# EAGLE design MOSFET PCB (EAGLE 9.4.2)
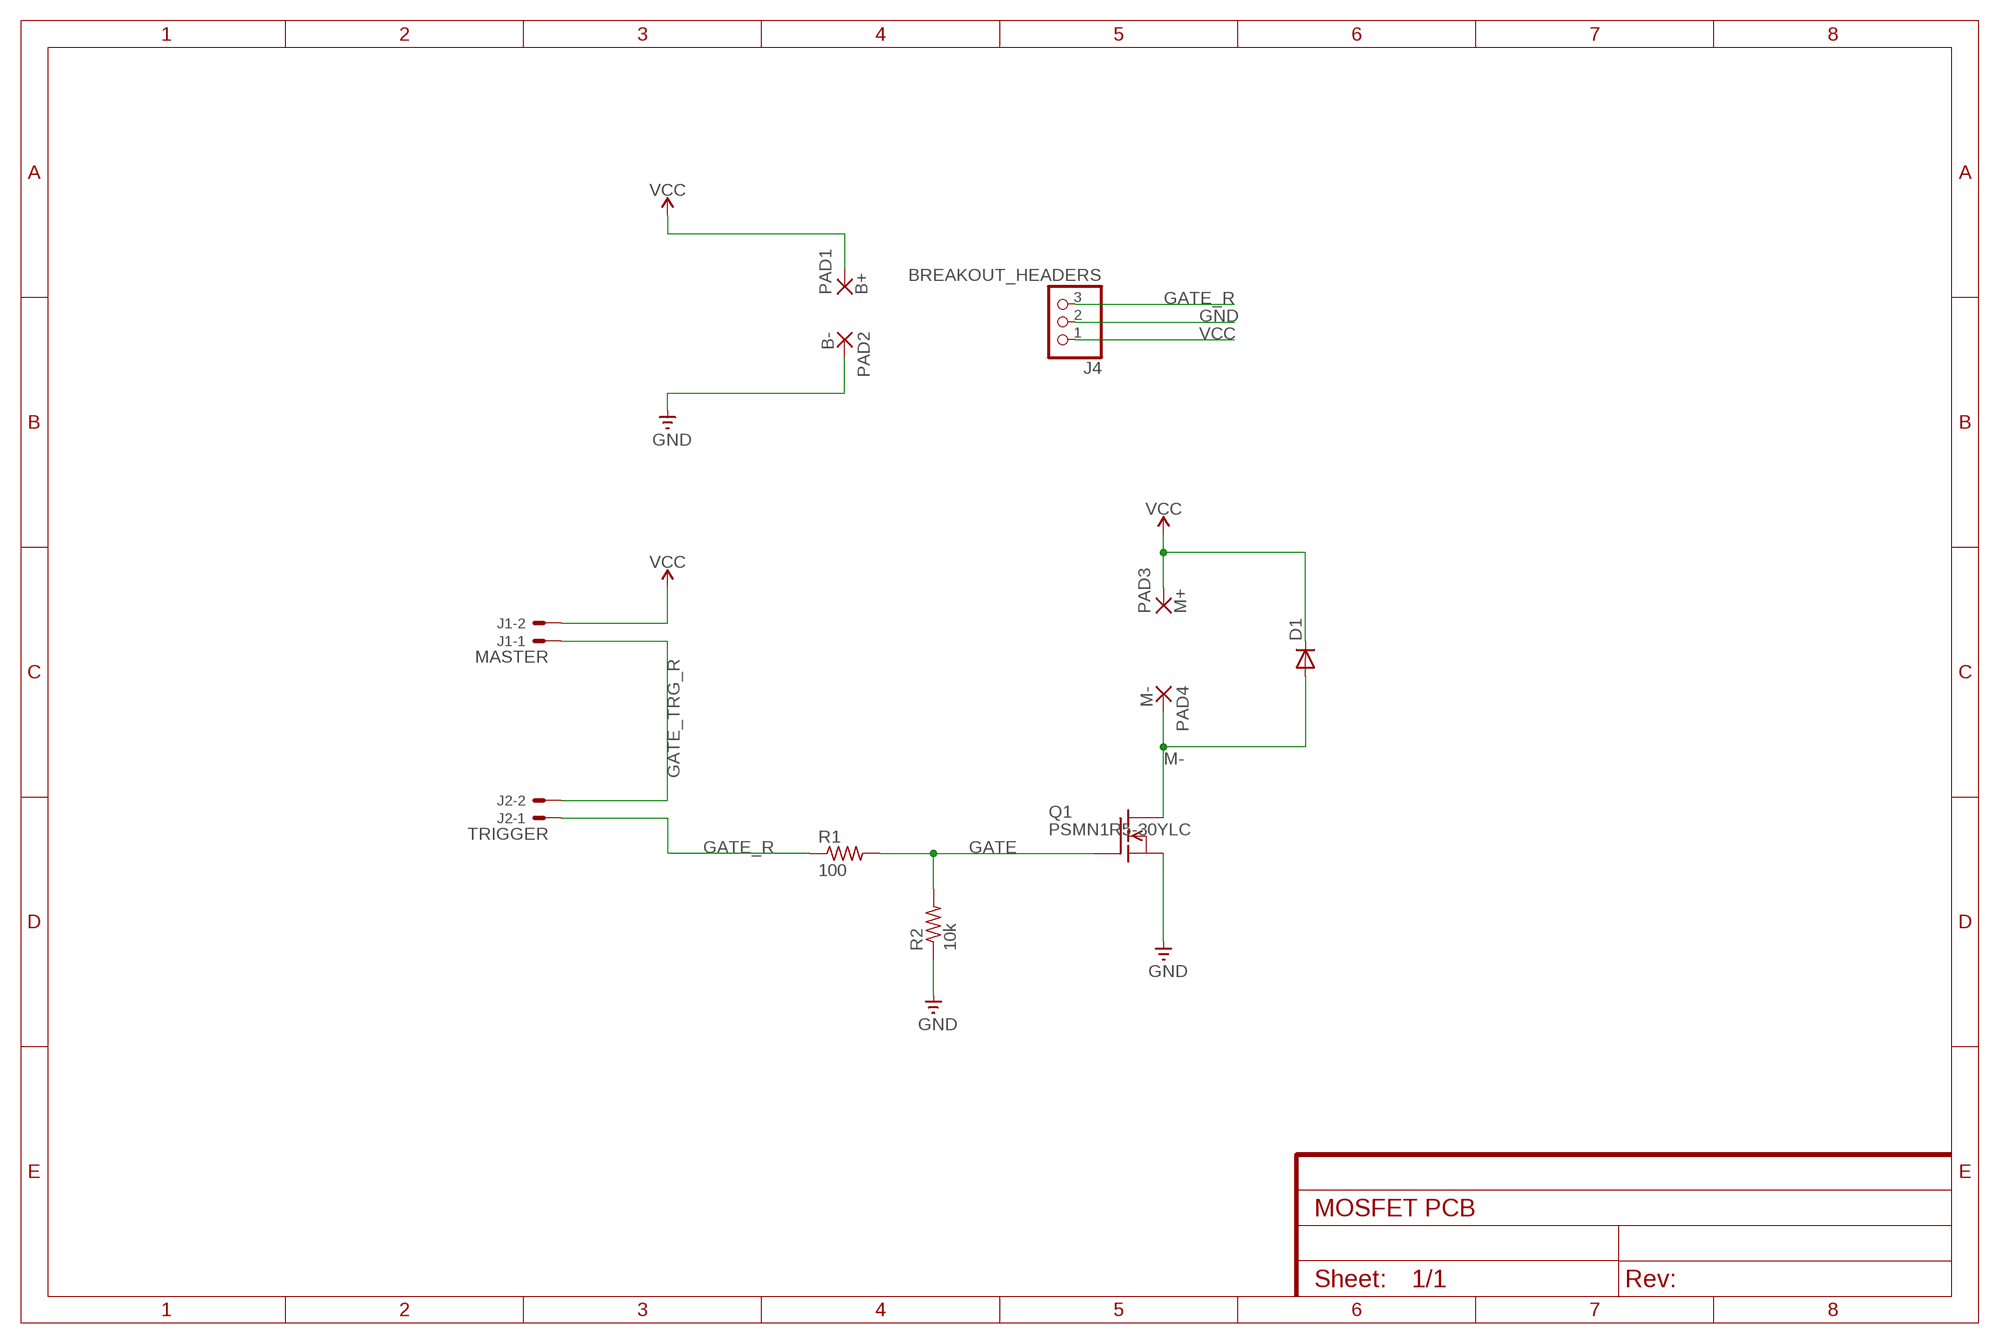
[diagram p0: schematic, sheet 1]

## Parts
D1  S2A  [DO214AA]
J1  MASTER  JST-XH-02-PIN-ROUND-PAD  [JST-XH-02-PACKAGE-ROUND-PAD]
J2  TRIGGER  JST-XH-02-PIN-ROUND-PAD  [JST-XH-02-PACKAGE-ROUND-PAD]
J4  BREAKOUT_HEADERS  PINHD-1X3  [1X03]
PAD1  B+  WIREPADSMD5-2,5  [5-2,5]
PAD2  B-  WIREPADSMD5-2,5  [5-2,5]
PAD3  M+  WIREPADSMD5-2,5  [5-2,5]
PAD4  M-  WIREPADSMD5-2,5  [5-2,5]
Q1  PSMN1R5-30YLC  [TO127P600X120-5N]
R1  100  R-US_M0805  [M0805]
R2  10k  R-US_M0805  [M0805]

## Nets
GATE: Q1.4(G) R1.2 R2.2
GATE_R: J2.1 J4.3 R1.1
GATE_TRG_R: J1.1 J2.2
GND: J4.2 PAD2.1(P) Q1.1(S) Q1.2(S) Q1.3(S) R2.1
M-: D1.A PAD4.1(P) Q1.5(D)
VCC: D1.C J1.2 J4.1 PAD1.1(P) PAD3.1(P)

## Library data of the parts
D1 = s2x_10:S2*: S2A - S2M General Purpose Rectifiers Source: http://www.fairchildsemi.com/datasheets/S2/S2A.pdf; MF: Fairchild; MPN: S2A; OC_FARNELL: 1467485; OC_NEWARK: 58K2391
J1 J2 = Rembrandt Electronics - JST XH Connectors v1-0:JST-XH-02-PIN: JST XH Connector 2 Pin Wire to board connector. Pitch: 2,54 mm, (0.100") Number of pins: 2 Created by Rembrandt Electronics www.rembrandtelectronics.com
J4 = adafruit:PINHD-1X3: PIN HEADER
PAD1-PAD4 = wirepad:WIREPAD: Wire PAD connect wire on PCB
Q1 = my-eagle-lib:PSMN1R5-30YLC: PSMN1R5-30YLC N-Channel Power MOSFET 30V, 100A, 1.55mΩ logic level MOSFET, surface-mount SOT669 package Datasheet <https://assets.nexperia.com/documents/data-sheet/PSMN1R5-30YLC.pdf> DigiKey Buy Link <https://www.digikey.com/product-detail/en/nexperia-usa-inc/PSMN1R5-30YLC115/1727-5297-1-ND/2674291> Package stolen from here <https://www.mikrocontroller.net/topic/236049> Symbol stolen from here <https://github.com/adafruit/Adafruit-Eagle-Library>
R1 R2 = adafruit:R-US_: RESISTOR, American symbol

## Board
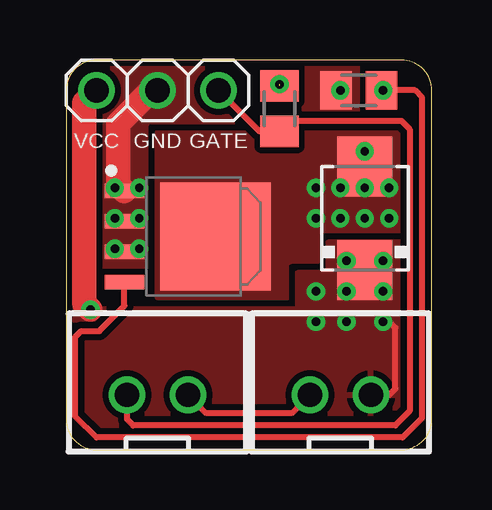
[diagram p1: board, top side]
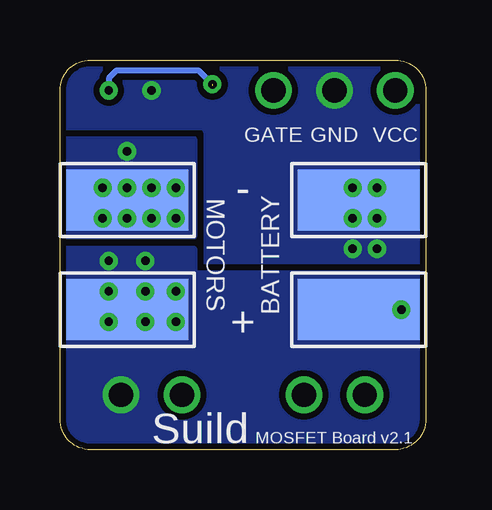
[diagram p2: board, bottom side, seen from below]

Size 15.24 x 16.26 mm. Coordinates in mm from the lower left corner, seen from the top.
Outline: 0,14.99 0,1.27 arc90 1.27,0 13.97,0 arc90 15.24,1.27 15.24,14.99 arc90 13.97,16.26 1.27,16.26 arc90 0,14.99
Copper layers (1*16): Top 0.035mm / dielectric 1.5mm / Bottom 0.035mm
Design rules "default *": minimum track width 6mil, minimum drill 0.35mm, track to track 10mil, track to pad 10mil, pad to pad 10mil, via to via 10mil, smd to smd 10mil, copper to edge 10mil, drill to drill 10mil, minimum pad ring 10mil, minimum via ring 8mil, stop-mask expansion 4mil, vias tented up to drill 30mil, thermal gap 10mil

### Footprints (pad centres in the part's own frame; a part is rotated, then mirrored left to right if it is on the bottom)
DO214AA = smd 2.5 x 2.3: A 2.15,0; C -2.15,0
JST-XH-02-PACKAGE-ROUND-PAD = drill 1.016: 1 -1.27,0; 2 1.27,0
1X03 = drill 1.016: 1 -2.54,0; 2 0,0; 3 2.54,0
5-2,5 = smd 2.54 x 5.08: 1 0,0
TO127P600X120-5N = smd 1.65 x 0.6: 1 -2.65,1.905; 2 -2.65,0.635; 3 -2.65,-0.635; 4 -2.65,-1.905 | smd 4.6 x 4.5: 5 1.15,0
M0805 = smd 1.3 x 1.6: 1 -0.95,0; 2 0.95,0

### Placement (x,y rotation side)
D1  12.45,9.65 90 top
J1  11.43,2.29 0 top
J2  3.81,2.29 0 top
J4  3.81,14.99 0 top
PAD1  12.45,5.84 270 bottom
PAD2  2.79,10.41 270 bottom
PAD3  2.79,5.84 270 bottom
PAD4  12.45,10.41 270 bottom
Q1  5.08,8.89 0 top
R1  8.89,14.22 90 top
R2  12.19,14.99 0 top

### Tracks (layer width: path | path; a pad name or v marks a point on that pad's centre or on a via)
GATE  (via drill 0.35)  (1 unrouted)
  Top 0.254: R2.2 v13.21,14.99 14.54,14.99 14.83,14.7 14.83,1.32 14.02,0.51 1.27,0.51 0.38,1.4 0.38,4.7 0.63,4.95 1.38,4.95 2.43,6 Q1.4
  Bottom 0.254: v8.89,15.24 9.46,15.81 12.89,15.81 13.21,15.49 v13.21,14.99
GATE_R
  Top 0.254: J4.3 8.06,13.27 R1.1 9.33,13.72 13.97,13.72 14.32,13.37 14.32,1.62 13.72,1.02 2.79,1.02 2.54,1.27 J2.1
GATE_TRG_R
  Top 0.254: J2.2 5.84,1.52 9.4,1.52 J1.1
GND  (via drill 0.35)
  Top 1.016: Q1.1 2.18,11.05 2.18,13.61 3.56,14.99 J4.2
  Bottom 0.254: PAD2.1 2.29,9.91 1.07,9.91 0.38,10.59
  Bottom 0.508: PAD2.1 2.92,10.54
  other vias: 2.03,10.92 2.03,9.65 3.05,9.65 3.05,10.92 2.03,8.38 3.05,8.38 11.43,14.99
  pour Top (rank 3, no thermals): -0.51,16.51 -0.51,-0.76 16.26,-0.76 16.26,16.51
  pour Bottom (rank 3, no thermals): -0.76,16.51 -0.76,-0.76 16.51,-0.76 16.51,16.51
M-  (via drill 0.35)
  Top 0.254: D1.A 12.84,12.19
  Bottom 0.254: 12.83,9.78 12.95,9.65
  other vias: 10.41,10.92 10.41,9.65 11.43,9.65 11.43,10.92 12.45,10.92 12.45,9.65 13.46,9.65 13.46,10.92 12.45,12.45
  pour Top (rank 2, no thermals): 12.19,13.21 16,13.21 16,6.35 3.81,6.35 3.81,13.21
  pour Bottom (rank 2, no thermals): 9.65,8.89 15.75,8.89 15.75,12.95 9.65,12.95
VCC  (via drill 0.35)
  Top 0.254: J1.2 13.46,2.29 13.72,2.54 13.72,5.08 13.46,5.33 v13.21,5.33
  Top 1.016: J4.1 0.76,14.48 0.76,6.1 v1.02,5.84
  Bottom 0.254: PAD1.1 12.7,5.59 12.58,5.47
  other vias: 11.68,6.6 10.41,6.6 11.68,7.87 13.21,7.87 10.41,5.33 11.68,5.33 13.21,6.6
  pour Top (no thermals): 10.92,8.64 10.92,7.37 9.65,7.37 9.65,4.32 15.24,4.32 15.24,8.64
  pour Top (rank 2): 16,5.84 -0.51,5.84 -0.51,-0.51 16,-0.51
  pour Bottom (no thermals): -0.51,7.37 -0.51,-0.76 16,-0.76 16,8.38 9.65,8.38 9.65,7.37

### Text on the board
tNames: VCC | GND | GATE
bNames: VCC | GND | GATE | - | BATTERY | MOTORS | + | MOSFET Board v2.1 | Suild